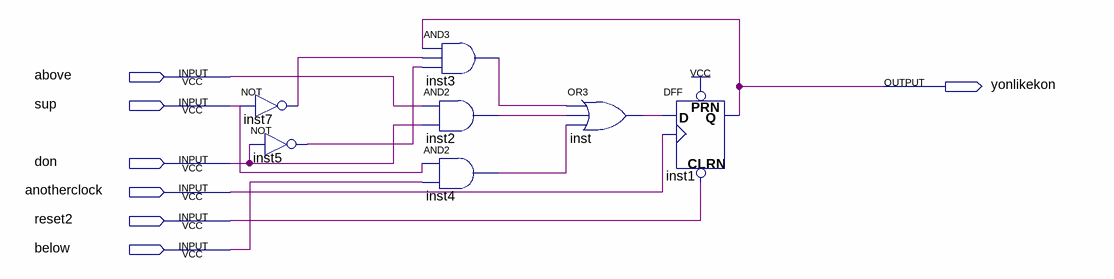
[diagram p0: schematic sheet]
// Quartus schematic ydff.bdf as structural Verilog: 7 symbols, 7 pins
module ydff (
  input  above,
  input  sup,
  input  don,
  input  anotherclock,
  input  reset2,
  input  below,
  output yonlikekon
);

  wire inst2_out, inst3_out, inst4_out, inst5_out, inst7_out, inst_out;

  not inst7 (inst7_out, sup);
  not inst5 (inst5_out, don);
  and inst3 (inst3_out, yonlikekon, inst7_out, inst5_out);
  and inst2 (inst2_out, above, don);
  and inst4 (inst4_out, sup, below);
  or inst (inst_out, inst3_out, inst2_out, inst4_out);
  DFF inst1 (.CLRN(reset2), .CLK(anotherclock), .D(inst_out), .PRN(1'b1), .Q(yonlikekon));
endmodule
